# Altium schematic sheet ws2812b.SchDoc
size Letter; SheetNumber: 6; SheetTotal: 8
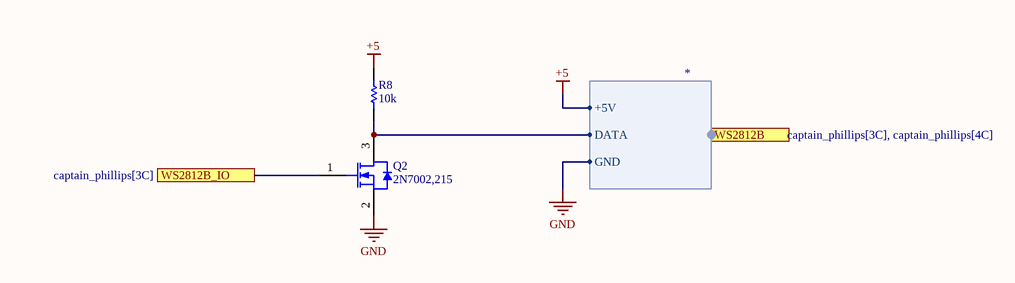
[diagram p0: ws2812b.SchDoc]

## Parts
Q2  2N7002,215  [NXP-SOT23-3_V]
R8  value 10k  [RESC1608X55X25ML10T15]  (hidden comment: 10K 1 0603)

## Ports
WS2812B (harness *, see captain_phillips[3C], captain_phillips[4C]), WS2812B_IO (see captain_phillips[3C])

## Harnesses
*: +5V, DATA, GND

## Nets
+5: R8.2 ; port WS2812B.+5V
GND: Q2.2(S) ; port WS2812B.GND
WS2812B_IO: Q2.1(G) ; port WS2812B_IO
NetQ2_3: Q2.3(D) R8.1 ; port WS2812B.DATA

## Library data of the parts
Q2 = CMP-013-00011-5: N-channel Trench MOSFET, 60 V, 300 mA, -65 to 150 degC, 3-Pin SOT-23 (TO-236AB), RoHS, Tape and Reel; Manufacturer: NXP Semiconductors; Input Capacitance: 50pF; Max Dual Supply Voltage: 60V; Power: 830mW; Elements: 1; Package Version: Feb-16; Rds On Max: 5Ohm; Nominal Vgs: 2V; Pins: 8; Max Operating Temperature: 150°C; Package Quantity: 1; LCSC Part Number: C8545; Vds Max: 60V; Package Description: 3-Pin Small Outline Transistor, Body 1.3 x 2.9 mm, Pitch 0.95 mm; Packaging: TapeandReel; Mounting Technology: SM; Datasheet URL: http://www.nxp.com/documents/data_sheet/2N7002.pdf; Case/Package: TO-236-3; Datasheet Version: Rev. 7, 09/2011; Package Reference: SOT23-3; Nominal Dual Supply Voltage: 60V; RoHS Compliant: True; Min Operating Temperature: -65°C
R8 = CMP-0103-0607-9: 0603 (1608 Metric) 1/10 W 10K 1 Thick Film Chip Resistor; Power: 100mW; Tolerance: 1%; Case-EIA: 0603; Case-Metric: 1608; Temp. Coefficent: ±100; LCSC Part Number: C25804; Technology: SMT; Case/Package: 0603